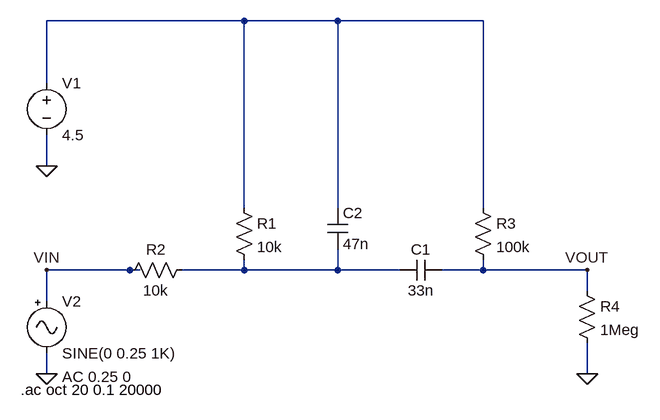
[diagram p0: schematic dist_1_to_2.asc]
dist_1_to_2.asc, the LTspice schematic file:
Version 4
SHEET 1 880 680
WIRE 48 -144 -256 -144
WIRE 192 -144 48 -144
WIRE 416 -144 192 -144
WIRE -256 -48 -256 -144
WIRE -256 80 -256 32
WIRE 48 144 48 -144
WIRE 192 144 192 -144
WIRE 416 144 416 -144
WIRE -128 240 -256 240
WIRE -112 240 -128 240
WIRE 48 240 48 224
WIRE 48 240 -48 240
WIRE 192 240 192 208
WIRE 192 240 48 240
WIRE 288 240 192 240
WIRE 416 240 416 224
WIRE 416 240 352 240
WIRE 576 240 416 240
WIRE 576 272 576 240
WIRE -256 288 -256 240
WIRE -256 400 -256 368
WIRE 576 400 576 352
FLAG -256 80 0
FLAG 576 400 0
FLAG -256 400 0
FLAG -256 240 VIN
FLAG 576 240 VOUT
SYMBOL res 32 128 R0
SYMATTR InstName R1
SYMATTR Value 10k
SYMBOL res 400 128 R0
SYMATTR InstName R3
SYMATTR Value 100k
SYMBOL res 560 256 R0
SYMATTR InstName R4
SYMATTR Value 1Meg
SYMBOL cap 352 224 R90
WINDOW 0 0 32 VBottom 2
WINDOW 3 32 32 VTop 2
SYMATTR InstName C1
SYMATTR Value 33n
SYMBOL voltage -256 -64 R0
WINDOW 123 0 0 Left 0
WINDOW 39 0 0 Left 0
SYMATTR InstName V1
SYMATTR Value 4.5
SYMBOL Misc\\signal -256 272 R0
WINDOW 123 24 132 Left 2
WINDOW 39 0 0 Left 0
SYMATTR Value2 AC 0.25 0
SYMATTR InstName V2
SYMATTR Value SINE(0 0.25 1K)
SYMBOL res -32 224 R90
WINDOW 0 0 56 VBottom 2
WINDOW 3 32 56 VTop 2
SYMATTR InstName R2
SYMATTR Value 10k
SYMBOL cap 176 144 R0
SYMATTR InstName C2
SYMATTR Value 47n
TEXT -296 424 Left 2 !.ac oct 20 0.1 20000

The netlist it stands for:
* dist_1_to_2.asc
R1 N001 N002 10k
R3 N001 VOUT 100k
R4 VOUT 0 1Meg
C1 VOUT N002 33n
V1 N001 0 4.5
V2 VIN 0 SINE(0 0.25 1K) AC 0.25 0
R2 N002 VIN 10k
C2 N001 N002 47n
.ac oct 20 0.1 20000
.backanno
.end

* Results of the author's LTspice run, read from the files saved beside the schematic
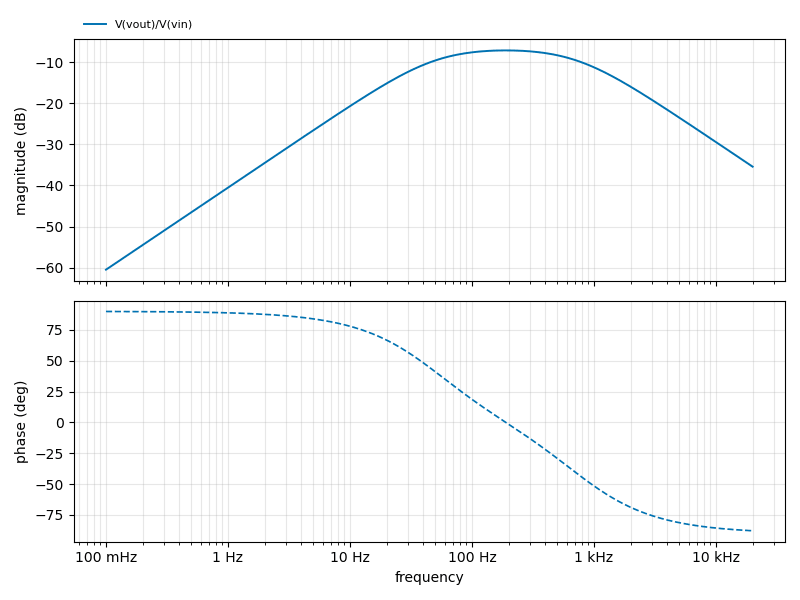
[diagram p1: AC Analysis of dist_1_to_2.asc, plotted from the saved traces]
* AC Analysis, 1 run:
*   V(vout)/V(vin): -60.51 dB at 100 mHz, -35.43 dB at 20 kHz, peak -7.11 dB at 191.1 Hz, 3 dB below the peak at 44.26 Hz and 811.7 Hz